# EAGLE design PC_CapSense (EAGLE 6.2)

## Sheet 1 of 2
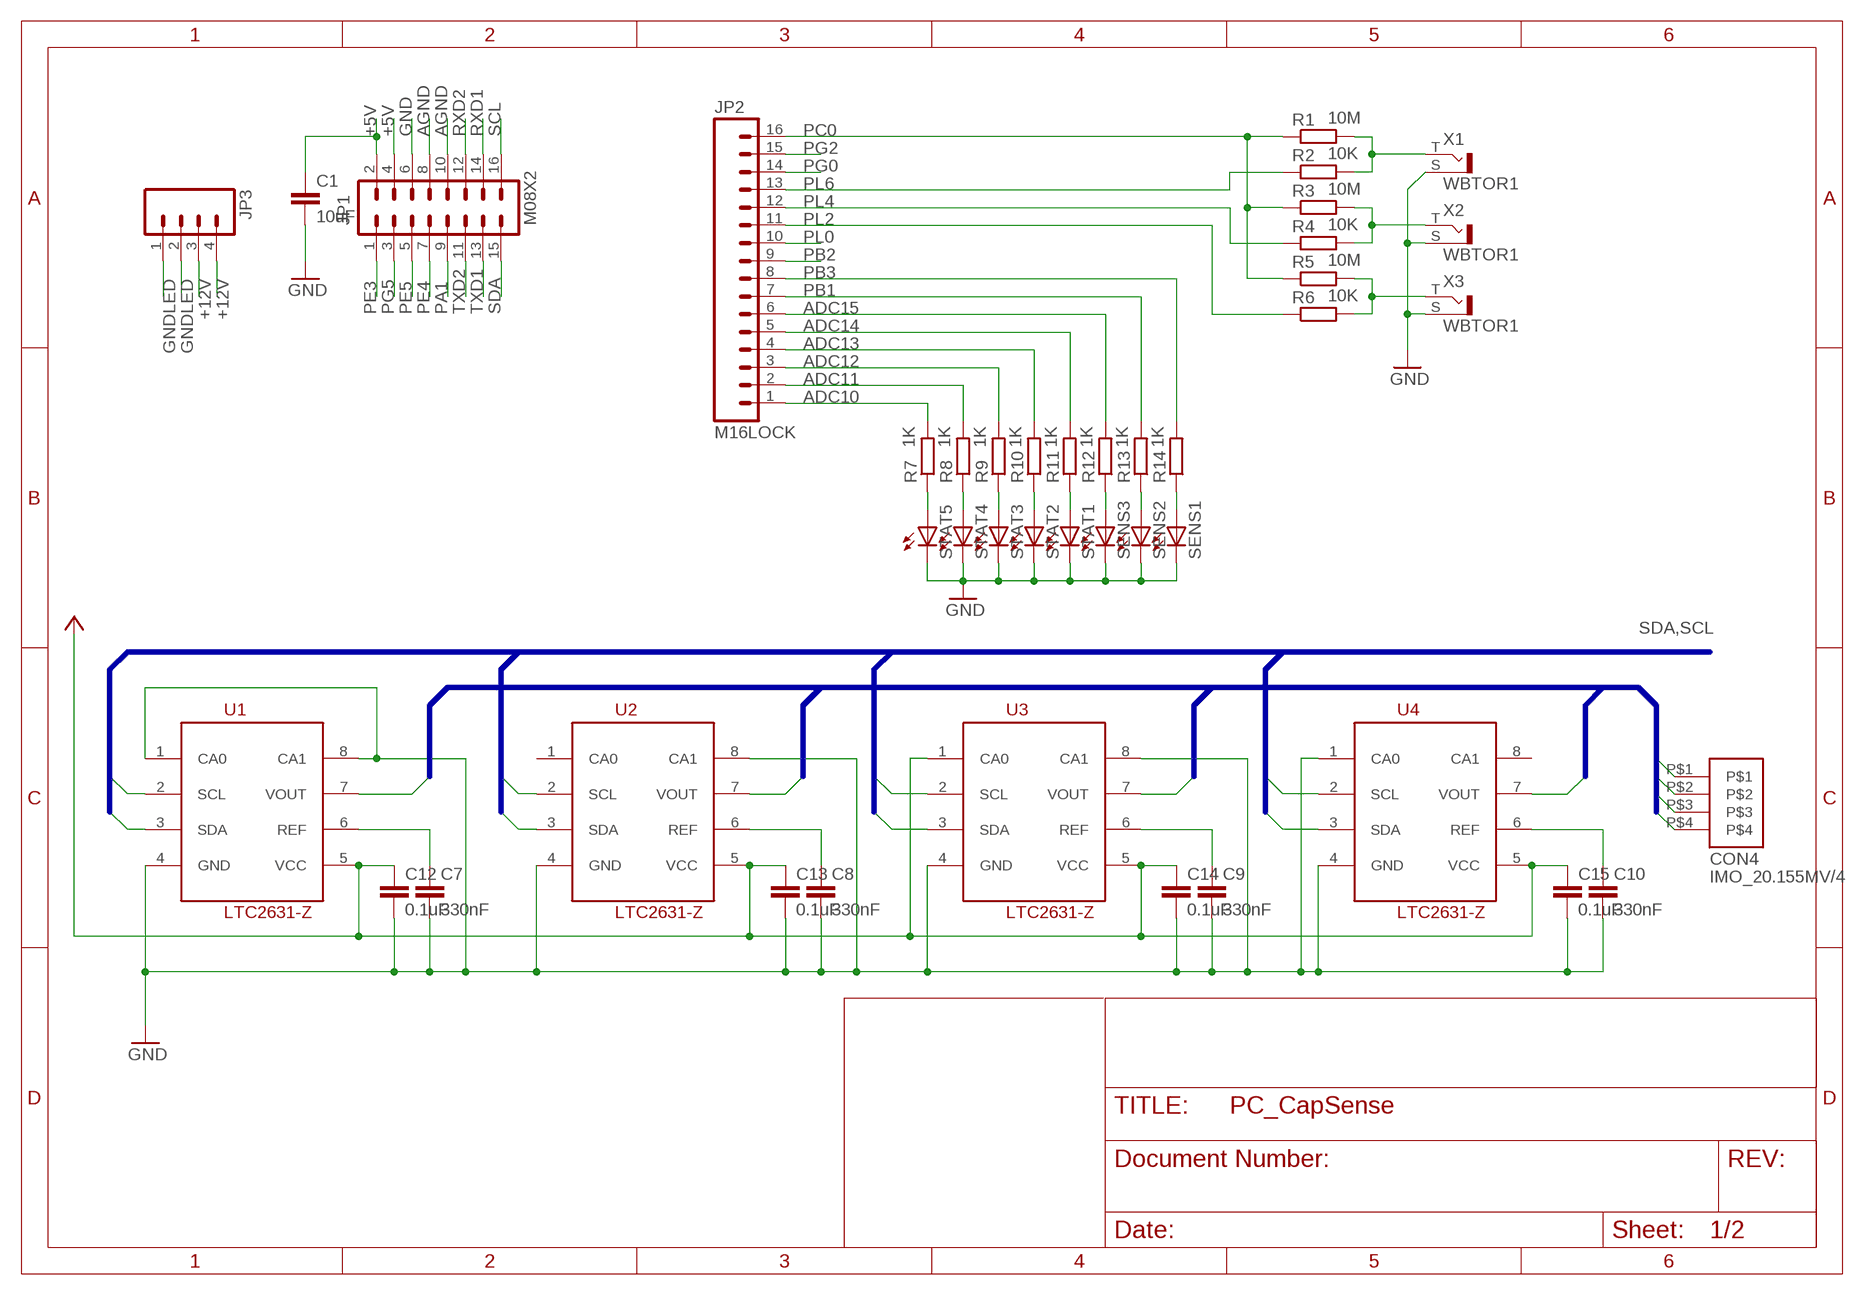
[diagram p0: schematic, sheet 1]

### Parts
C1  10uF  C-EUC0805  [C0805]
C7  330nF  C-EUC0805K  [C0805K]
C8  330nF  C-EUC0805K  [C0805K]
C9  330nF  C-EUC0805K  [C0805K]
C10  330nF  C-EUC0805K  [C0805K]
C12  0.1uF  C-EUC0805K  [C0805K]
C13  0.1uF  C-EUC0805K  [C0805K]
C14  0.1uF  C-EUC0805K  [C0805K]
C15  0.1uF  C-EUC0805K  [C0805K]
CON4  IMO_20.155MV/4  [IMO_20.155MV/4]
JP1  M08X2  [2X8]
JP2  M16LOCK  [1X16_LOCK]
JP3  M04LONGPADS  [1X04_LONGPADS]
R1  10M  R-EU_M0805  [M0805]
R2  10K  R-EU_M0805  [M0805]
R3  10M  R-EU_M0805  [M0805]
R4  10K  R-EU_M0805  [M0805]
R5  10M  R-EU_M0805  [M0805]
R6  10K  R-EU_M0805  [M0805]
R7  1K  R-EU_M0805  [M0805]
R8  1K  R-EU_M0805  [M0805]
R9  1K  R-EU_M0805  [M0805]
R10  1K  R-EU_M0805  [M0805]
R11  1K  R-EU_M0805  [M0805]
R12  1K  R-EU_M0805  [M0805]
R13  1K  R-EU_M0805  [M0805]
R14  1K  R-EU_M0805  [M0805]
SENS1  LED3MM  [LED3MM]
SENS2  LED3MM  [LED3MM]
SENS3  LED3MM  [LED3MM]
STAT1  LED3MM  [LED3MM]
STAT2  LED3MM  [LED3MM]
STAT3  LED3MM  [LED3MM]
STAT4  LED3MM  [LED3MM]
STAT5  LED3MM  [LED3MM]
U1  LTC2631-Z  [TSOT23-8]
U2  LTC2631-Z  [TSOT23-8]
U3  LTC2631-Z  [TSOT23-8]
U4  LTC2631-Z  [TSOT23-8]
X1  WBTOR1  [WBTOR1]
X2  WBTOR1  [WBTOR1]
X3  WBTOR1  [WBTOR1]

### Nets
+5V: C1.1 C12.1 C13.1 C14.1 C15.1 JP1.2 JP1.4 U1.5(VCC) U2.5(VCC) U3.1(CA0) U3.5(VCC) U4.5(VCC)
+12V: JP3.3 JP3.4
ADC10: JP2.1 R7.2
ADC11: JP2.2 R8.2
ADC12: JP2.3 R9.2
ADC13: JP2.4 R10.2
ADC14: JP2.5 R11.2
ADC15: JP2.6 R12.2
AGND: JP1.8 JP1.10 X1.S X2.S X3.S ; supply symbol labelled GND
GND: C1.2 C7.2 C8.2 C9.2 C10.2 C12.2 C13.2 C14.2 C15.2 JP1.6 U1.1(CA0) U1.4(GND) U1.8(CA1) U2.4(GND) U2.8(CA1) U3.4(GND) U3.8(CA1) U4.1(CA0) U4.4(GND)
GNDLED: JP3.1 JP3.2 SENS1.K(C) SENS2.K(C) SENS3.K(C) STAT1.K(C) STAT2.K(C) STAT3.K(C) STAT4.K(C) STAT5.K(C) ; supply symbol labelled GND
N$2: R1.2 R2.2 X1.T
N$3: R3.2 R4.2 X2.T
N$4: R5.2 R6.2 X3.T
N$5: R7.1 STAT5.A
N$6: R8.1 STAT4.A
N$7: R9.1 STAT3.A
N$8: R10.1 STAT2.A
N$9: R11.1 STAT1.A
N$10: R12.1 SENS3.A
N$11: R13.1 SENS2.A
N$12: R14.1 SENS1.A
N$17: C10.1 U4.6(REF)
N$18: C9.1 U3.6(REF)
N$19: C8.1 U2.6(REF)
N$20: C7.1 U1.6(REF)
PA1: JP1.9
PB1: JP2.7 R13.2
PB2: JP2.9
PB3: JP2.8 R14.2
PC0: JP2.16 R1.1 R3.1 R5.1
PE3: JP1.1
PE4: JP1.7
PE5: JP1.5
PG0: JP2.14
PG2: JP2.15
PG5: JP1.3
PL0: JP2.10
PL2: JP2.11 R6.1
PL4: JP2.12 R4.1
PL6: JP2.13 R2.1
RXD1: JP1.14
RXD2: JP1.12
SCL: JP1.16 U1.2(SCL) U2.2(SCL) U3.2(SCL) U4.2(SCL)
SDA: JP1.15 U1.3(SDA) U2.3(SDA) U3.3(SDA) U4.3(SDA)
TXD1: JP1.13
TXD2: JP1.11
VOUT0: CON4.P$1 U1.7(VOUT)
VOUT1: CON4.P$2 U2.7(VOUT)
VOUT2: CON4.P$3 U3.7(VOUT)
VOUT3: CON4.P$4 U4.7(VOUT)
Unconnected: U2.1(CA0) U4.8(CA1)

### Buses
VOUT[0..3]
SDA,SCL

## Sheet 2 of 2
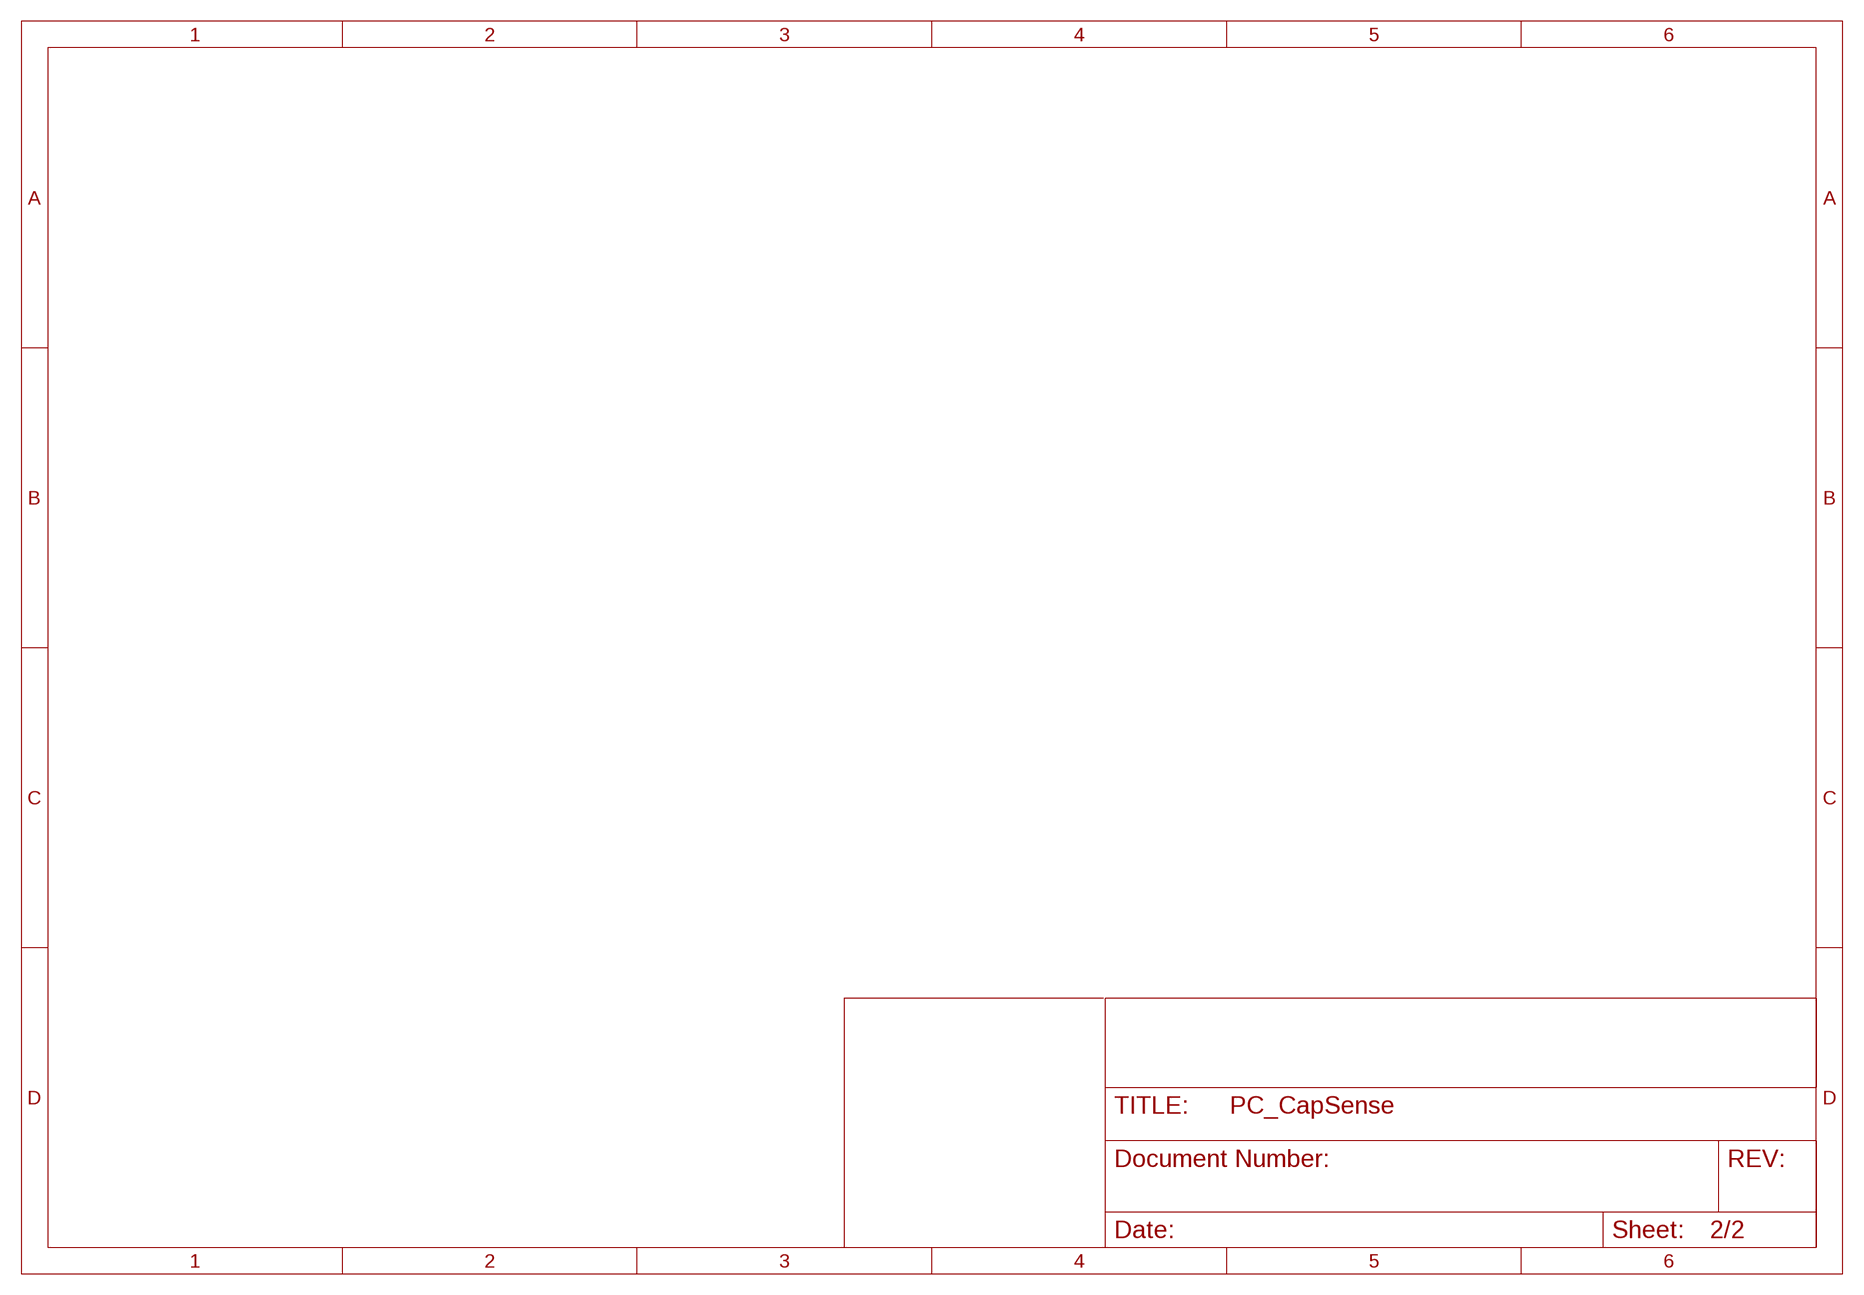
[diagram p1: schematic, sheet 2]

## Library data of the parts
C1 C7-C10 C12-C15 = rcl:C-EU: CAPACITOR, European symbol
CON4 = CONNECTORS:IMO_20.155MV/4
JP1 = SparkFun:M08X2
JP2 = SparkFun:M16
JP3 = SparkFun:M04: Header 4 Standard 4-pin 0.1" header. Use with straight break away headers (SKU : PRT-00116), right angle break away headers (PRT-00553), swiss pins (PRT-00743), machine pins (PRT-00117), and female headers (PRT-00115). Molex polarized connector foot print use with SKU : PRT-08231 with associated crimp pins and housings. 1MM SMD Version SKU: PRT-10208
R1-R14 = resistor:R-EU_: RESISTOR, European symbol
SENS1-SENS3 STAT1-STAT5 = led:LED: LED OSRAM: - CHIPLED LG R971, LG N971, LY N971, LG Q971, LY Q971, LO R971, LY R971 LH N974, LH R974 LS Q976, LO Q976, LY Q976 LO Q996 - Hyper CHIPLED LW Q18S LB Q993, LB Q99A, LB R99A - SideLED LS A670, LO A670, LY A670, LG A670, LP A670 LB A673, LV A673, LT A673, LW A673 LH A674 LY A675 LS A676, LA A676, LO A676, LY A676, LW A676 LS A679, LY A679, LG A679 - Hyper Micro SIDELED® LS Y876, LA Y876, LO Y876, LY Y876 LT Y87S - SmartLED LW L88C, LW L88S LB L89C, LB L89S, LG L890 LS L89K, LO L89K, LY L89K LS L896, LA L896, LO L896, LY L896 - TOPLED LS T670, LO T670, LY T670, LG T670, LP T670 LSG T670, LSP T670, LSY T670, LOP T670, LYG T670 LG T671, LOG T671, LSG T671 LB T673, LV T673, LT T673, LW T673 LH T674 LS T676, LA T676, LO T676, LY T676, LB T676, LH T676, LSB T676, LW T676 LB T67C, LV T67C, LT T67C, LS T67K, LO T67K, LY T67K, LW E67C LS E67B, LA E67B, LO E67B, LY E67B, LB E67C, LV E67C, LT E67C LW T67C LS T679, LY T679, LG T679 LS T770, LO T770, LY T770, LG T770, LP T770 LB T773, LV T773, LT T773, LW T773 LH T774 LS E675, LA E675, LY E675, LS T675 LS T776, LA T776, LO T776, LY T776, LB T776 LHGB T686 LT T68C, LB T68C - Hyper Mini TOPLED® LB M676 - Mini TOPLED Santana® LG M470 LS M47K, LO M47K, LY M47K Source: http://www.osram.convergy.de LUXEON: - LUMILED® LXK2-PW12-R00, LXK2-PW12-S00, LXK2-PW14-U00, LXK2-PW14-V00 LXK2-PM12-R00, LXK2-PM12-S00, LXK2-PM14-U00 LXK2-PE12-Q00, LXK2-PE12-R00, LXK2-PE12-S00, LXK2-PE14-T00, LXK2-PE14-U00 LXK2-PB12-K00, LXK2-PB12-L00, LXK2-PB12-M00, LXK2-PB14-N00, LXK2-PB14-P00, LXK2-PB14-Q00 LXK2-PR12-L00, LXK2-PR12-M00, LXK2-PR14-Q00, LXK2-PR14-R00 LXK2-PD12-Q00, LXK2-PD12-R00, LXK2-PD12-S00 LXK2-PH12-R00, LXK2-PH12-S00 LXK2-PL12-P00, LXK2-PL12-Q00, LXK2-PL12-R00 Source: www.luxeon.com KINGBRIGHT: KA-3528ASYC Source: www.kingbright.com
U1-U4 = V2_:LTC2631: Single 12-/10-/8-Bit I2C VOUT DACs with 10ppm/°C Reference
X1-X3 = con-lumberg:WBTOR1: RCA connectors according to JEITA RC-5231 Cinch RCA-Einbaukupplung nach JEITA RC-5231, abgewinkelte Ausführung Source: http://www.lumberg.de/Produkte/PDFs/WBTOR1.pdf; MPN: WBTOR 1 BLACK; OC_FARNELL: 1200146; OC_NEWARK: 98K2588

## Board
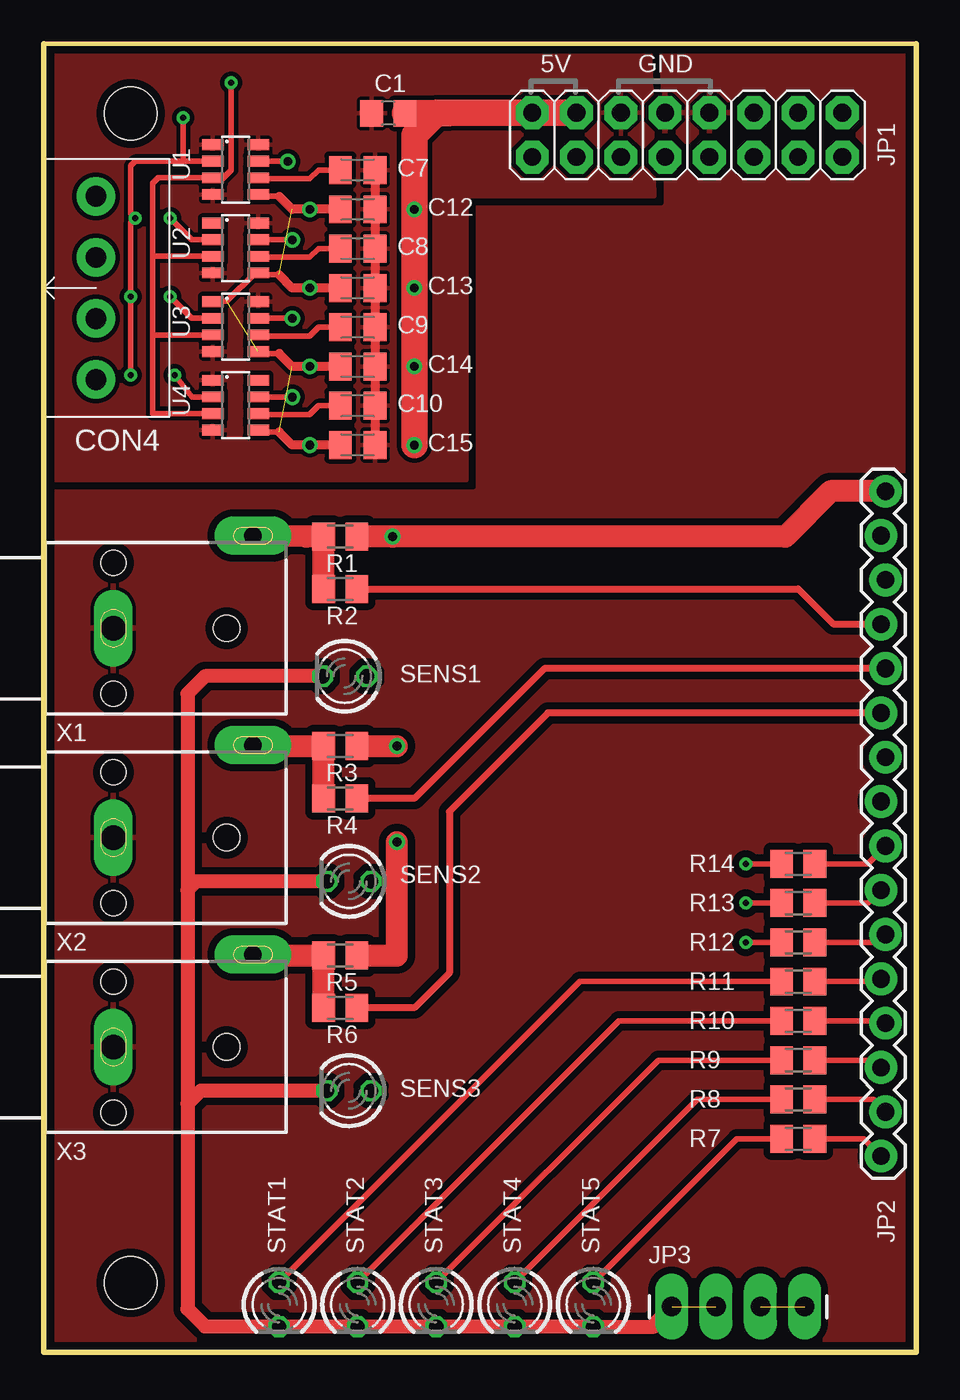
[diagram p2: board, top side]
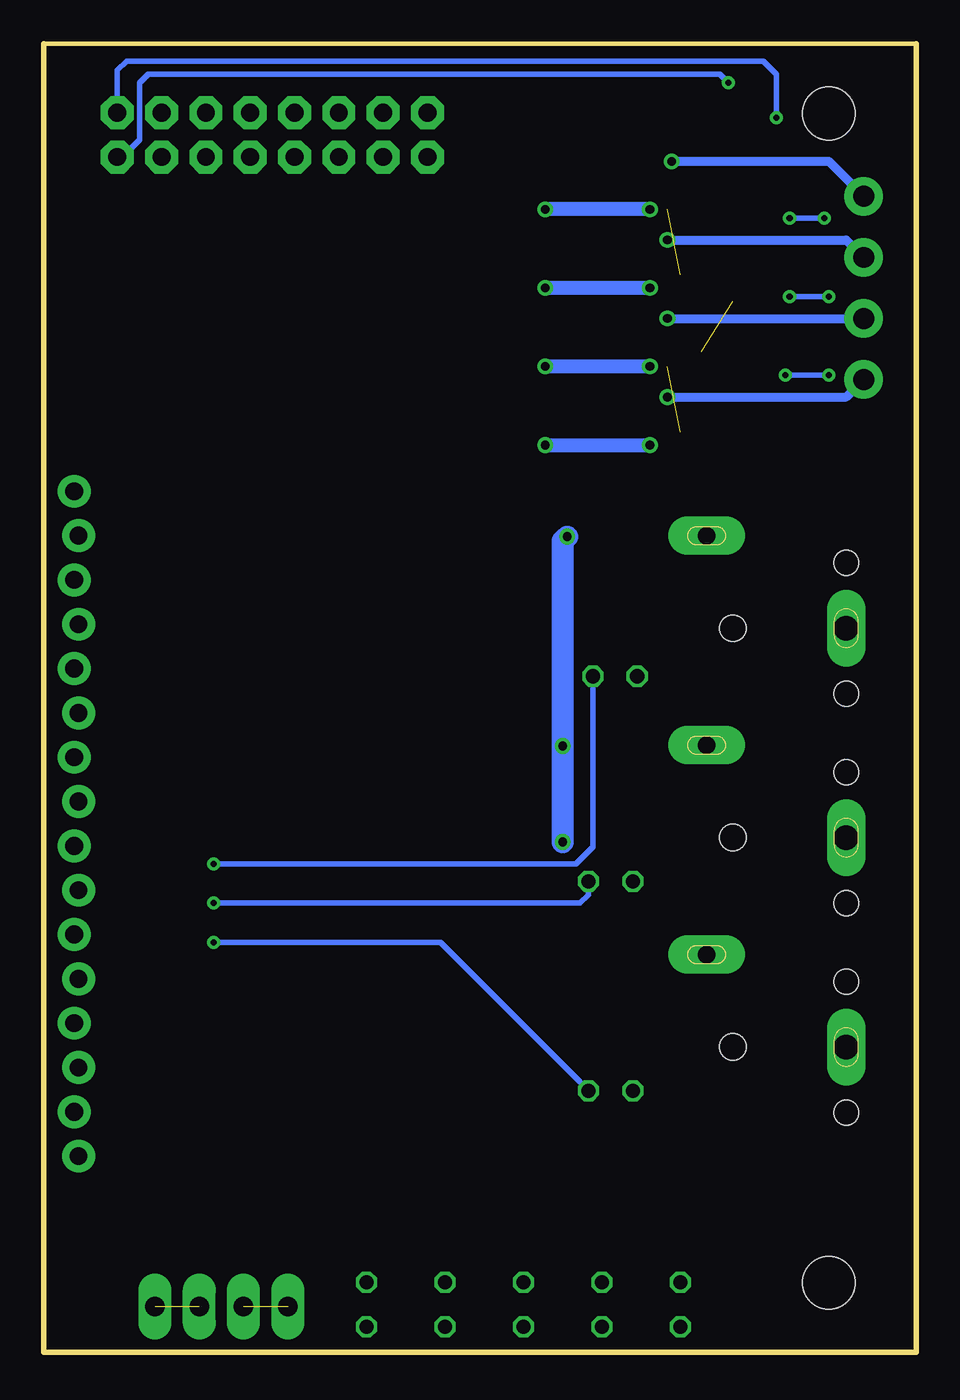
[diagram p3: board, bottom side, seen from below]

Size 50 x 75 mm. Coordinates in mm from the lower left corner, seen from the top.
Outline: 0,0 50,0 50,75 0,75 0,0
Copper layers (1*16): Top 0.018mm / dielectric 1.55mm / Bottom 0.018mm
Design rules: minimum track width 0.15mm, minimum drill 0.25mm, track to track 0.15mm, track to pad 0.15mm, pad to pad 0.15mm, via to via 0.15mm, smd to smd 0.15mm, copper to edge 0.45mm, drill to drill 0.3mm, minimum pad ring 0.2mm, minimum via ring 0.2mm, stop-mask expansion 0.1mm, vias tented up to drill 0mil, thermal gap 0.2mm
Holes 3 mm at 5,71 5,4

### Footprints (pad centres in the part's own frame; a part is rotated, then mirrored left to right if it is on the bottom)
C0805 = smd 1.3 x 1.5: 1 -0.95,0; 2 0.95,0
C0805K = smd 1.3 x 1.6: 1 -1,0; 2 1,0
IMO_20.155MV/4 = drill 1.2 pad 2.2: P$1 -5.25,0; P$2 -1.75,0; P$3 1.75,0; P$4 5.25,0
2X8 = drill 1.016 pad 1.88 octagon: 1 0,0; 2 0,2.54; 3 2.54,0; 4 2.54,2.54; 5 5.08,0; 6 5.08,2.54; 7 7.62,0; 8 7.62,2.54; 9 10.16,0; 10 10.16,2.54; 11 12.7,0; 12 12.7,2.54; 13 15.24,0; 14 15.24,2.54; 15 17.78,0; 16 17.78,2.54
1X16_LOCK = drill 1.016 pad 1.88: 1 0,0.127; 2 2.54,-0.127; 3 5.08,0.127; 4 7.62,-0.127; 5 10.16,0.127; 6 12.7,-0.127; 7 15.24,0.127; 8 17.78,-0.127; 9 20.32,0.127; 10 22.86,-0.127; 11 25.4,0.127; 12 27.94,-0.127; 13 30.48,0.127; 14 33.02,-0.127; 15 35.56,0.127; 16 38.1,-0.127
1X04_LONGPADS = drill 1.118 pad 1.88 long: 1 0,0; 2 2.54,0; 3 5.08,0; 4 7.62,0
M0805 = smd 1.3 x 1.6: 1 -0.95,0; 2 0.95,0
LED3MM = drill 0.813 octagon: A -1.27,0; K 1.27,0
TSOT23-8 = smd 0.62 x 1.22: 1 -1.458,-1.3; 2 -0.508,-1.3; 3 0.442,-1.3; 4 1.392,-1.3; 5 1.392,1.3; 6 0.442,1.3; 7 -0.508,1.3; 8 -1.458,1.3
WBTOR1 = drill 1.4 pad 2.2 long: S 0,-4 | drill 1 pad 2.2 long: T 5.3,-12 | hole 1.4: -3.75,-4; 3.75,-4 | hole 1.5: 0,-10.5

### Placement (x,y rotation side)
C1  19.75,71 180 top
C7  18,67.75 0 top
C8  18,63.25 0 top
C9  18,58.75 0 top
C10  18,54.25 0 top
C12  18,65.5 0 top
C13  18,61 0 top
C14  18,56.5 0 top
C15  18,52 0 top
CON4  3,61 270 top
JP1  28,68.5 0 top
JP2  48.12,11.25 90 top
JP3  36,2.62 0 top
R1  17,46.75 180 top
R2  17,43.75 180 top
R3  17,34.75 180 top
R4  17,31.75 180 top
R5  17,22.75 180 top
R6  17,19.75 180 top
R7  43.25,12.25 0 top
R8  43.25,14.5 0 top
R9  43.25,16.75 0 top
R10  43.25,19 0 top
R11  43.25,21.25 0 top
R12  43.25,23.5 0 top
R13  43.25,25.75 0 top
R14  43.25,28 0 top
SENS1  17.25,38.75 180 top
SENS2  17.5,27 180 top
SENS3  17.5,15 180 top
STAT1  13.5,2.75 270 top
STAT2  18,2.75 270 top
STAT3  22.5,2.75 270 top
STAT4  27,2.75 270 top
STAT5  31.5,2.75 270 top
U1  11,67.75 270 top
U2  11,63.25 270 top
U3  11,58.75 270 top
U4  11,54.25 270 top
X1  0,41.5 90 top
X2  0,29.5 90 top
X3  0,17.5 90 top

### Tracks (layer width: path | path; a pad name or v marks a point on that pad's centre or on a via)
+5V  (via drill 0.5)  (3 unrouted)
  Top 0.305: 13.5,66.25 12.41,66.25 U1.5 | 13.5,61.75 12.41,61.75 U2.5 12.11,61.86 10.5,60.25 9.74,60.25 U3.1 | 13.5,57.25 12.41,57.25 U3.5 | 13.5,52.75 12.41,52.75 U4.5 | 14.25,52 C15.1
  Top 0.508: C12.1 v15.25,65.5 14.25,65.5 13.5,66.25 | C13.1 v15.25,61 14.25,61 13.5,61.75 | C14.1 v15.25,56.5 14.25,56.5 13.5,57.25 | C15.1 v15.25,52 14.25,52 13.5,52.75
  Top 1.524: v21.25,52 21.25,69.75 22.54,71.04 23.25,71.04 | 23.25,71.04 JP1.2 JP1.4 | C1.1 23.21,71 23.25,71.04
  Bottom 0.813: v21.25,52 v15.25,52 | v15.25,56.5 v21.25,56.5 | v15.25,61 v21.25,61 | v15.25,65.5 v21.25,65.5
+12V  (1 unrouted)
ADC10
  Top 0.305: R7.2 47,12.25 JP2.1
ADC11
  Top 0.305: R8.2 47.54,14.5 JP2.2
ADC12
  Top 0.305: R9.2 47.58,16.75 JP2.3
ADC13
  Top 0.305: R10.2 48.12,19 JP2.4
ADC14
  Top 0.305: R11.2 47.84,21.25 JP2.5
ADC15
  Top 0.305: R12.2 47.8,23.5 JP2.6
AGND
  pour Top (isolate 0.406, rank 2): -0.75,49.5 24.75,49.5 24.75,75.5 51,75.5 51.25,-1.75 -2.5,-2.25 -0.5,47.75
GND
  Top 0.508: C7.2 C12.2 C8.2 C13.2 C9.2 C14.2 C10.2 C15.2
  pour Top (isolate 0.254): -0.25,50.25 0,50 24.25,50 24.25,66.25 35,66.25 34.75,75 50.25,76 -1,76 -1.5,75.5 -1.5,50.25
GNDLED  (1 unrouted)
  Top 0.813: SENS1.K 9.25,38.75 8.25,37.75 8.25,26.5 | 8.25,26.5 8.25,14.25 | 8.25,14.25 8.25,2.5 9.25,1.5 13.48,1.5 STAT1.K STAT2.K STAT3.K STAT4.K STAT5.K 34.98,1.48 34.98,1.6 JP3.1 | SENS2.K 8.75,27 8.25,26.5 | 16.25,15 SENS3.K 9,15 8.25,14.25
N$2
  Top 1.27: X1.T 15.05,46.75 R1.2 R2.2
N$3
  Top 1.27: X2.T 12.05,34.75 R3.2 R4.2
N$4
  Top 1.27: X3.T 12.05,22.75 R5.2 R6.2
N$5
  Top 0.305: R7.1 39.73,12.25 STAT5.A
N$6
  Top 0.305: R8.1 37.48,14.5 STAT4.A
N$7
  Top 0.305: R9.1 35.23,16.75 STAT3.A
N$8
  Top 0.305: R10.1 32.98,19 STAT2.A
N$9
  Top 0.305: R11.1 30.73,21.25 STAT1.A
N$10  (via drill 0.35)
  Top 0.305: v40.25,23.5 R12.1
  Bottom 0.305: SENS3.A 19.27,15.52 27.25,23.5 v40.25,23.5
N$11  (via drill 0.35)
  Top 0.305: R13.1 v40.25,25.75
  Bottom 0.305: SENS2.A 18.77,26.23 19.25,25.75 v40.25,25.75
N$12  (via drill 0.35)
  Top 0.305: v40.25,28 R14.1
  Bottom 0.305: SENS1.A 18.52,28.98 19.5,28 v40.25,28
N$17
  Top 0.305: C10.1 15.75,54.25 15.25,53.75 12.36,53.75 U4.6
N$18
  Top 0.305: C9.1 15.75,58.75 15.25,58.25 12.36,58.25 U3.6
N$19
  Top 0.305: C8.1 15.75,63.25 15.25,62.75 12.36,62.75 U2.6
N$20
  Top 0.305: C7.1 15.75,67.75 15.25,67.25 12.36,67.25 U1.6
PB1
  Top 0.305: R13.2 47.26,25.75 JP2.7
PB3
  Top 0.305: R14.2 47.22,28 JP2.8
PC0  (via drill 0.5)
  Top 1.27: JP2.16 45.1,49.35 42.5,46.75 v20,46.75 R1.1 | R5.1 20.25,22.75 v20.25,29.25 | R3.1 v20.25,34.75
  Bottom 1.27: v20.25,29.25 v20.25,34.75 20.25,46.5 v20,46.75
PL2
  Top 0.406: JP2.11 28.9,36.65 23.25,31 23.25,21.75 21.25,19.75 R6.1
PL4
  Top 0.406: JP2.12 28.69,39.19 21.25,31.75 R4.1
PL6
  Top 0.406: R2.1 43.25,43.75 45.25,41.75 47.98,41.75 JP2.13
SCL  (via drill 0.35)
  Top 0.305: U1.2 8,68.26 | U4.2 8.5,54.75 v7.5,56 | U3.2 8.49,59.26 v7.25,60.5 | U2.2 8.49,63.76 v7.25,65 | v8,70.75 8,68.26 | 8,68.26 5.26,68.26 5,68 5,65.25 v5.25,65 5,64.75 v5,60.5 v5,56
  Bottom 0.305: v7.25,65 v5.25,65 | JP1.16 45.78,73.47 45.25,74 8.75,74 8,73.25 v8,70.75 | v7.25,60.5 v5,60.5 | v7.5,56 v5,56
SDA  (via drill 0.35)
  Top 0.305: 6.25,62.75 6.25,67 6.56,67.31 U1.3 9.76,67.25 10.25,67.25 10.75,67.75 v10.75,72.75 | 6.25,62.75 6.25,58.25 | 6.25,58.25 6.25,53.8 U4.3 | U2.3 6.31,62.81 6.25,62.75 | U3.3 6.31,58.31 6.25,58.25
  Bottom 0.305: JP1.15 45.75,68.47 45.53,68.47 44.5,69.5 44.5,72.75 44,73.25 11.25,73.25 v10.75,72.75
VOUT0  (via drill 0.5)
  Top 0.305: U1.7 v13.99,68.26 v14,68.25
  Bottom 0.508: v14,68.25 5,68.25 CON4.P$1
VOUT1  (via drill 0.5)
  Top 0.305: U2.7 v14.24,63.76 v14.25,63.75
  Bottom 0.508: v14.25,63.75 4,63.75 CON4.P$2
VOUT2  (via drill 0.5)
  Top 0.305: U3.7 v14.24,59.26 v14.25,59.25
  Bottom 0.508: v14.25,59.25 CON4.P$3
VOUT3  (via drill 0.5)
  Top 0.305: U4.7 v14.24,54.76 v14.25,54.75
  Bottom 0.508: v14.25,54.75 4,54.75 CON4.P$4

### Text on the board
tNames: 5V | GND
tDocu: Plant Sensor Board v1.0 | http://www.simbits.nl
200bmp: /Volumes/Development/__documents__/_Simbits/Huisstijl/logo/simbits_logo_bw.bmp